# Altium project MultiChannelFlex.PrjPcb
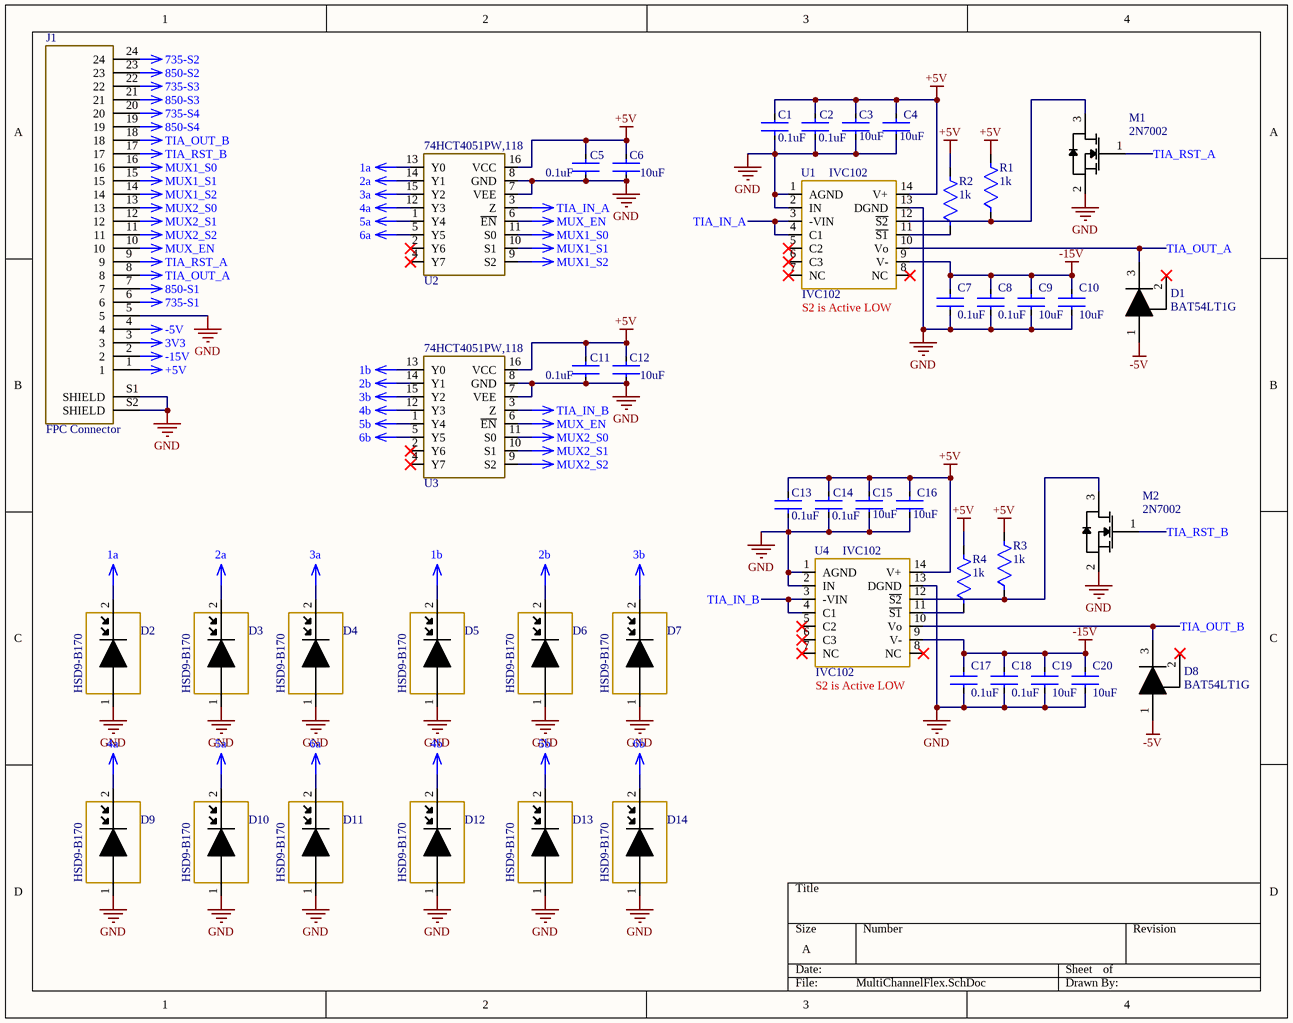
[diagram p0: MultiChannelFlex.SchDoc]
2 sheets, 69 parts. Net scope: global (net labels, ports and power ports of the same name join across sheets).
Board file: PCB2.PcbDoc
Sheets:
  MultiChannelFlex.SchDoc
  MultiChannelFlex_LED.SchDoc

## Sheet MultiChannelFlex.SchDoc
size A; SheetNumber: 1; SheetTotal: 2

### Parts
C1  0.1uF  [CAPC3216X180N]
C2  0.1uF  [CAPC3216X180N]
C3  10uF  [CAPC3216X180N]
C4  10uF  [CAPC3216X180N]
C5  0.1uF  [CAPC3216X180N]
C6  10uF  [CAPC3216X180N]
C7  0.1uF  [CAPC3216X180N]
C8  0.1uF  [CAPC3216X180N]
C9  10uF  [CAPC3216X180N]
C10  10uF  [CAPC3216X180N]
C11  0.1uF  [CAPC3216X180N]
C12  10uF  [CAPC3216X180N]
C13  0.1uF  [CAPC3216X180N]
C14  0.1uF  [CAPC3216X180N]
C15  10uF  [CAPC3216X180N]
C16  10uF  [CAPC3216X180N]
C17  0.1uF  [CAPC3216X180N]
C18  0.1uF  [CAPC3216X180N]
C19  10uF  [CAPC3216X180N]
C20  10uF  [CAPC3216X180N]
D1  BAT54LT1G  [BAT54LT1]
D2  HSD9-B170  [HSD9-B170]  (value not drawn)
D3  HSD9-B170  [HSD9-B170]  (value not drawn)
D4  HSD9-B170  [HSD9-B170]  (value not drawn)
D5  HSD9-B170  [HSD9-B170]  (value not drawn)
D6  HSD9-B170  [HSD9-B170]  (value not drawn)
D7  HSD9-B170  [HSD9-B170]  (value not drawn)
D8  BAT54LT1G  [BAT54LT1]
D9  HSD9-B170  [HSD9-B170]  (value not drawn)
D10  HSD9-B170  [HSD9-B170]  (value not drawn)
D11  HSD9-B170  [HSD9-B170]  (value not drawn)
D12  HSD9-B170  [HSD9-B170]  (value not drawn)
D13  HSD9-B170  [HSD9-B170]  (value not drawn)
D14  HSD9-B170  [HSD9-B170]  (value not drawn)
J1  FPC Connector  [TE_FPC]
M1  2N7002  [STM-SOT-23-3_V]
M2  2N7002  [STM-SOT-23-3_V]
R1  1k  [R1206]
R2  1k  [R1206]
R3  1k  [R1206]
R4  1k  [R1206]
U1  IVC102  [D0014A_M]
U2  8x1 Analog MUX TSSOP16  [TSSOP-16]  (value not drawn)
U3  8x1 Analog MUX TSSOP16  [TSSOP-16]  (value not drawn)
U4  IVC102  [D0014A_M]

### Nets
1a: D2.2 U2.13(Y0)
1b: D5.2 U3.13(Y0)
2a: D3.2 U2.14(Y1)
2b: D6.2 U3.14(Y1)
3a: D4.2 U2.15(Y2)
3b: D7.2 U3.15(Y2)
3V3: J1.3
4a: D9.2 U2.12(Y3)
4b: D12.2 U3.12(Y3)
5a: D10.2 U2.1(Y4)
5b: D13.2 U3.1(Y4)
6a: D11.2 U2.5(Y5)
6b: D14.2 U3.5(Y5)
735-S1: J1.6
735-S2: J1.24
735-S3: J1.22
735-S4: J1.20
850-S1: J1.7
850-S2: J1.23
850-S3: J1.21
850-S4: J1.19
+5V: C1.2 C2.1 C3.1 C4.1 C5.1 C6.1 C11.1 C12.1 C13.2 C14.1 C15.1 C16.1 J1.1 R1.2 R2.2 R3.2 R4.2 U1.14(V+) U2.16(VCC) U3.16(VCC) U4.14(V+)
-5V: D1.1(A) D8.1(A) J1.4
-15V: C7.1 C8.1 C9.1 C10.1 C17.1 C18.1 C19.1 C20.1 J1.2 U1.9(V-) U4.9(V-)
GND: C1.1 C2.2 C3.2 C4.2 C5.2 C6.2 C7.2 C8.2 C9.2 C10.2 C11.2 C12.2 C13.1 C14.2 C15.2 C16.2 C17.2 C18.2 C19.2 C20.2 D2.1 D3.1 D4.1 D5.1 D6.1 D7.1 D9.1 D10.1 D11.1 D12.1 D13.1 D14.1 J1.5 J1.S1(SHIELD) J1.S2(SHIELD) M1.2(S) M2.2(S) U1.1(AGND) U1.2(IN) U1.13(DGND) U2.7(VEE) U2.8(GND) U3.7(VEE) U3.8(GND) U4.1(AGND) U4.2(IN) U4.13(DGND)
MUX1_S0: J1.16 U2.11(S0)
MUX1_S1: J1.15 U2.10(S1)
MUX1_S2: J1.14 U2.9(S2)
MUX2_S0: J1.13 U3.11(S0)
MUX2_S1: J1.12 U3.10(S1)
MUX2_S2: J1.11 U3.9(S2)
MUX_EN: J1.10 U2.6(~{EN}) U3.6(~{EN})
TIA_IN_A: U1.3(-VIN) U1.4(C1) U2.3(Z)
TIA_IN_B: U3.3(Z) U4.3(-VIN) U4.4(C1)
TIA_OUT_A: D1.3(K) J1.8 U1.10(Vo)
TIA_OUT_B: D8.3(K) J1.18 U4.10(Vo)
TIA_RST_A: J1.9 M1.1(G)
TIA_RST_B: J1.17 M2.1(G)
NetM1_3: M1.3(D) R1.1 U1.12(~{S2})
NetM2_3: M2.3(D) R3.1 U4.12(~{S2})
NetR2_1: R2.1 U1.11(~{S1})
NetR4_1: R4.1 U4.11(~{S1})

Not connected (* = marked no-connect by the designer): D1 2(NC)*; D8 2(NC)*; U1 5(C2)* 6(C3)* 7(NC)* 8(NC)*; U2 2(Y6)* 4(Y7)*; U3 2(Y6)* 4(Y7)*; U4 5(C2)* 6(C3)* 7(NC)* 8(NC)*

### Notes on the sheet
- (near U1) S2 is Active LOW
- (near U4) S2 is Active LOW
- (in symbol 74HCT4051PW) 74HCT4051PW,118

### Library data of the parts
C1 C2 C5 C7 C8 C11 C13 C14 C17 C18 = C1206C104K5RAC7210: 1206; Manufacturer: KEMET; Tolerance: 0.1; Material: Ceramic; Voltage Rating: 50 V; Temperature Characteristic: X7R; Automotive Grade: Grade 0; Capacitance: 0.10 μF; Value: 0.10 μF; Temperature Coefficient: 15%; Device Class L3: Ceramic Capacitors; ComponentLink2URL: https://content.kemet.com/datasheets/KEM_C1007_X8R_ULTRA_150C_SMD.pdf; Temperature Range Low: -55°C; RoHS: TRUE; Temperature Range High: +150°C; Automotive: Yes; Height: 0.88mm; Manufacturer Part Number: C1206C104K5RAC7210; Temperature: -55°C to +150°C; Octopart: https://octopart.com/c1206c104k5rac7210-kemet-3919856; Package: C1206C-EB; Mouser Description: Multilayer Ceramic Capacitors MLCC - SMD/SMT 50volts 0.1uF X7R 10%; Ipc Land Pattern Name: CAPC320160X78; Device Class L2: Capacitors; Category: Cap; Lead Free: Yes; ComponentLink2Description: Datasheet; Digikey Description: CAP CER 0.1UF 50V X7R 1206; Device Class L1: Passive Components
C3 C4 C6 C9 C10 C12 C15 C16 C19 C20 = CL31B106KOHNNWE: 1206
D1 D8 = BAT54L: Schottky Barrier Diode, 3-Pin SOT-23, Pb-Free, Tape and Reel; Manufacturer: On Semiconductor; IFSM Max (A): 0.6; Configuration: Single; trr Max (ns): 5; PackageVersion: Rev. AP, 11/2009; ComponentLink3Description: Package Specification; RoHS: TRUE; ComponentLink3URL: http://www.onsemi.cn/pub_link/Collateral/318-08.PDF; PackageDescription: 3-Pin Small Outline Transistor, Body 2.92 x 1.3 mm, Pitch 0.95 mm; DatasheetVersion: Rev. 12; ComponentLink1Description: Manufacturer URL; PartNumber: BAT54LT1G; ComponentLink2Description: Datasheet; Mounting Technology: Surface Mount; PackageReference: SOT-23-3-318-08; ComponentLink2URL: http://www.onsemi.cn/pub_link/Collateral/BAT54LT1-D.PDF; ComponentLink1URL: http://www.onsemi.com/; Packing: Tape and Reel
J1 = 2-1734592-4: 24 Position FPC Connector Contacts, Bottom 0.020" _0.50mm_ Surface Mount, Right Angle; MF: TE Connectivity; MP: 2-1734592-4; Value: *; Package: None; Price: None; SnapEDA_Link: https://www.snapeda.com/parts/2-1734592-4/TE%20Connectivity/view-part/4788511/?ref=snap; Availability: Unavailable
M1 M2 = 2N7002-TP: N-channel 60 V, 1.8 Ohm, 0.35 A STripFET(TM) II Power MOSFET, SOT23; Manufacturer: STMicroelectronics; PartNumber: 2N7002; ComponentLink2Description: Datasheet; ComponentLink2URL: http://www.st.com/st-web-ui/static/active/en/resource/technical/document/datasheet/CD00005134.pdf; ComponentLink1Description: Manufacturer URL; ComponentLink1URL: http://www.st.com/; DatasheetVersion: Rev. 9, 11/2008; PackageReference: SOT-23; Mounting Technology: Surface Mount; PackageDescription: 3-Pin SOT23, 3.016 x 2.8 mm Body, 0.95 mm Pitch
R1-R4 = RT1206BRD071KL: 1206 1kOhm
U2 U3 = 74HCT4051PW

## Sheet MultiChannelFlex_LED.SchDoc
size A; SheetNumber: 2; SheetTotal: 2
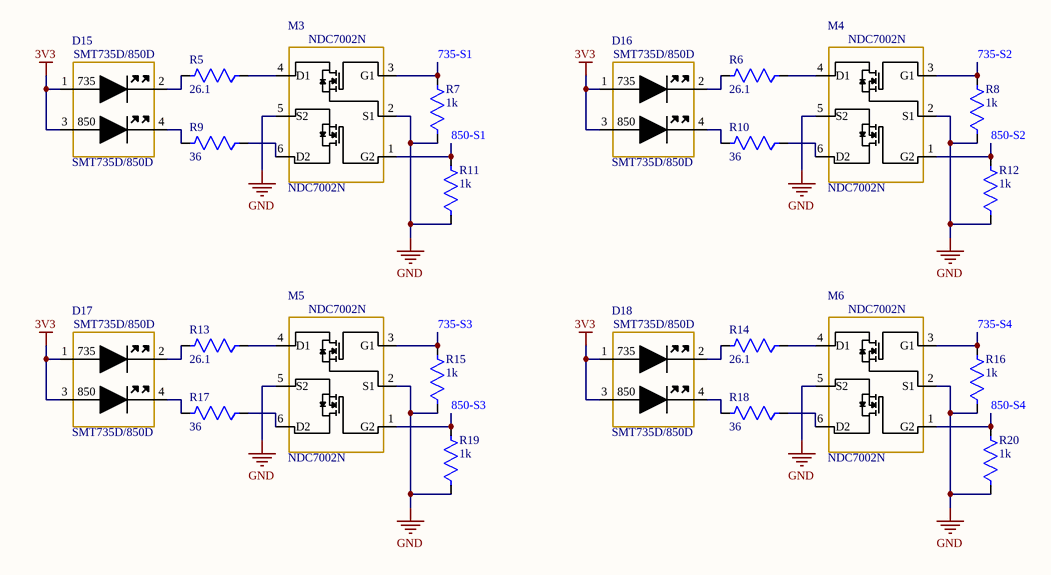
[diagram p1: MultiChannelFlex_LED.SchDoc]

### Parts
D15  SMT735D/850D  [SMT735D_850D]
D16  SMT735D/850D  [SMT735D_850D]
D17  SMT735D/850D  [SMT735D_850D]
D18  SMT735D/850D  [SMT735D_850D]
M3  NDC7002N  [FAIR-MA06A_V]
M4  NDC7002N  [FAIR-MA06A_V]
M5  NDC7002N  [FAIR-MA06A_V]
M6  NDC7002N  [FAIR-MA06A_V]
R5  26.1  [R1206]
R6  26.1  [R1206]
R7  1k  [R1206]
R8  1k  [R1206]
R9  36  [R1206]
R10  36  [R1206]
R11  1k  [R1206]
R12  1k  [R1206]
R13  26.1  [R1206]
R14  26.1  [R1206]
R15  1k  [R1206]
R16  1k  [R1206]
R17  36  [R1206]
R18  36  [R1206]
R19  1k  [R1206]
R20  1k  [R1206]

### Nets
3V3: D15.1 D15.3 D16.1 D16.3 D17.1 D17.3 D18.1 D18.3
735-S1: M3.3(G1) R7.2
735-S2: M4.3(G1) R8.2
735-S3: M5.3(G1) R15.2
735-S4: M6.3(G1) R16.2
850-S1: M3.1(G2) R11.2
850-S2: M4.1(G2) R12.2
850-S3: M5.1(G2) R19.2
850-S4: M6.1(G2) R20.2
GND: M3.2(S1) M3.5(S2) M4.2(S1) M4.5(S2) M5.2(S1) M5.5(S2) M6.2(S1) M6.5(S2) R7.1 R8.1 R11.1 R12.1 R15.1 R16.1 R19.1 R20.1
NetD15_2: D15.2 R5.2
NetD15_4: D15.4 R9.2
NetD16_2: D16.2 R6.2
NetD16_4: D16.4 R10.2
NetD17_2: D17.2 R13.2
NetD17_4: D17.4 R17.2
NetD18_2: D18.2 R14.2
NetD18_4: D18.4 R18.2
NetM3_4: M3.4(D1) R5.1
NetM3_6: M3.6(D2) R9.1
NetM4_4: M4.4(D1) R6.1
NetM4_6: M4.6(D2) R10.1
NetM5_4: M5.4(D1) R13.1
NetM5_6: M5.6(D2) R17.1
NetM6_4: M6.4(D1) R14.1
NetM6_6: M6.6(D2) R18.1

### Notes on the sheet
- (in symbol SMT735D/850D) 735; 850

### Library data of the parts
R5 R6 R13 R14 = RQ73C2B26R1BTD: 1206 26.1 Ohm; Manufacturer: TE; Power Rating: 0.4W; Value: 26.1Ω; Automotive Grade: Grade 0; Voltage Rating: 200V; Temperature Coefficient: 10ppm/°C; Tolerance: 0.1%; Automotive: Yes; Octopart: https://octopart.com/rq73c2b26r1btd-te+connectivity-93911368; Device Class L1: Passive Components; Category: Res; Series: RQ73; Resistance: 26.1Ω; Temperature: -55°C to +155°C; Device Class L3: Chip SMD Resistors; ComponentLink2URL: https://www.te.com/commerce/DocumentDelivery/DDEController?Action=showdoc&DocId=Data+Sheet%7F1773270-2%7FA%7Fpdf%7FEnglish%7FENG_DS_1773270-2_A.pdf%7F9-2176388-167; Composition: Thin Film; Manufacturer Part Number: RQ73C2B26R1BTD; Height: 0.75mm; Lead Free: Yes; Ipc Land Pattern Name: RESC310160X60; Temperature Range High: +155°C; ComponentLink2Description: Datasheet; Temperature Range Low: -55°C; RoHS: TRUE; Device Class L2: Resistors; Package: RQ732B
R7 R8 R11 R12 R15 R16 R19 R20 = RT1206BRD071KL: 1206 1kOhm
R9 R10 R17 R18 = RT1206BRD0736RL: 1206 36 Ohm; Manufacturer: Yageo; Tolerance: 0.1%; Additional Feature: HIGH PRECISION; Rated Power Dissipation (P): 250mW; Rated Temperature: 70°C; Resistance: 36R; Temperature Coefficient: 25ppm/°C; Working Voltage: 200V; Package Height: 0.55mm; Package Length: 3.1mm; Package Width: 1.6mm; Supplier 1: Digikey; Manufacturer Part Number: RT1206BRD0736RL; RoHS: Yes; Category: Chip SMD Resistors; Stock 1: 9860; Pricing 1: 1=0.33, 10=0.241, 50=0.1868, 100=0.166, 500=0.1245, 1000=0.10938 (USD); Mount: Surface Mount; Number of Pins: 2; Size Code: 1206; Min Operating Temperature: -55°C; Max Operating Temperature: 155°C; Resistor Type: FIXED RESISTOR; Construction: Chip; Package Style: SMTMeter; Packaging: Tape and Reel; Technology: THIN FILM; Termination: Wraparound; Reach SVHC Compliant: Yes; RoHS Compliant: Yes; ComponentLink1URL: https://datasheet.ciiva.com:443/pdfs/VipMasterIC/IC/YAGO/YAGO-S-A0008510989/YAGO-S-A0008510989-1.pdf?src-supplier=IHS+Markit; ComponentLink1Description: https://datasheet.ciiva.com:443/pdfs/VipMasterIC/IC/YAGO/YAGO-S-A0008510989/YAGO-S-A0008510989-1.pdf?src-supplier=IHS+Markit; ComponentLink2URL: https://datasheet.ciiva.com/2587/pyu-rt-1-to-0-05-rohs-l-5-2587658.pdf?src-supplier=Digikey; ComponentLink2Description: https://datasheet.ciiva.com/2587/pyu-rt-1-to-0-05-rohs-l-5-2587658.pdf?src-supplier=Digikey; ComponentLink3URL: https://datasheet.ciiva.com/12811/pyu-rt-1-to-0-05-rohs-l-4-12811975.pdf?src-supplier=Mouser; ComponentLink3Description: https://datasheet.ciiva.com/12811/pyu-rt-1-to-0-05-rohs-l-4-12811975.pdf?src-supplier=Mouser

## Nets that join several sheets
3V3: MultiChannelFlex (J1.3), MultiChannelFlex_LED (8 pins)
735-S1: MultiChannelFlex (J1.6), MultiChannelFlex_LED (M3.3 R7.2)
735-S2: MultiChannelFlex (J1.24), MultiChannelFlex_LED (M4.3 R8.2)
735-S3: MultiChannelFlex (J1.22), MultiChannelFlex_LED (M5.3 R15.2)
735-S4: MultiChannelFlex (J1.20), MultiChannelFlex_LED (M6.3 R16.2)
850-S1: MultiChannelFlex (J1.7), MultiChannelFlex_LED (M3.1 R11.2)
850-S2: MultiChannelFlex (J1.23), MultiChannelFlex_LED (M4.1 R12.2)
850-S3: MultiChannelFlex (J1.21), MultiChannelFlex_LED (M5.1 R19.2)
850-S4: MultiChannelFlex (J1.19), MultiChannelFlex_LED (M6.1 R20.2)
GND: MultiChannelFlex (47 pins), MultiChannelFlex_LED (16 pins)